# Altium schematic sheet LMR514203.3V.SchDoc
size A; SheetNumber: 10; SheetTotal: 15
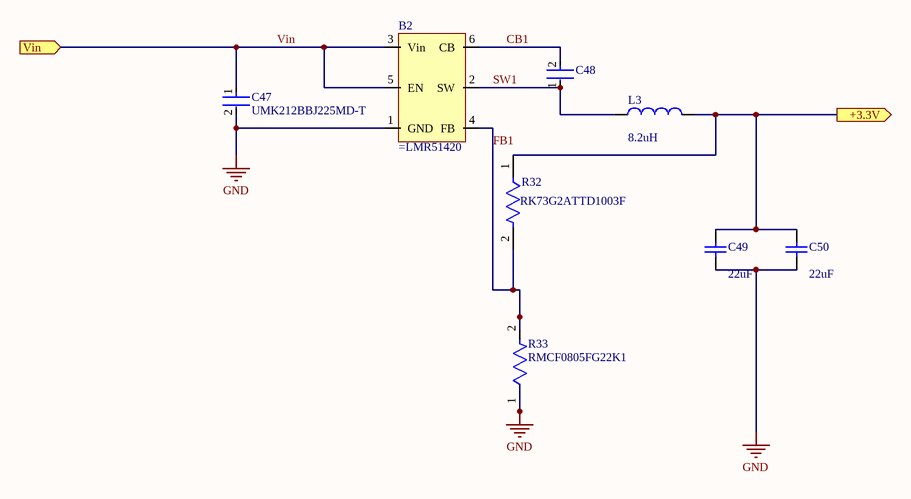
[diagram p0: LMR514203.3V.SchDoc]

## Parts
B2  (no value)  [LMR51420IC]
C47  UMK212BBJ225MD-T  [FP-0805-L_2_0_0_2-W_1_25-IPC_A]
C48  C0603C104K4PAC7867  [CAP CER 0.1UF 16V X7R 0603]  (value not drawn)
C49  value 22uF  [Cap22uF_C1206C226M4PAC7800]  (hidden comment: Comment)
C50  value 22uF  [Cap22uF_C1206C226M4PAC7800]  (hidden comment: Comment)
L3  value 8.2uH  [MSS1246H-103MED 10uH]  (hidden comment: MSS1260H-822MED)
R32  RK73G2ATTD1003F  [FP-RK73G2A-IPC_A]
R33  RMCF0805FG22K1  [FP-RMCF0805-IPC_B]

## Ports
+3.3V (out), Vin (in)

## Nets
GND: B2.1(GND) C47.2 C49.1 C50.1 R33.1
+3.3V: C49.2 C50.2 L3.2 R32.1 ; port +3.3V
CB1: B2.6(CB) C48.2
FB1: B2.4(FB) R32.2 R33.2
SW1: B2.2(SW) C48.1 L3.1
Vin: B2.3(Vin) B2.5(EN) C47.1 ; port Vin

## Library data of the parts
B2 = Component_1
C47 = CMP-14477-004278-2: Multilayer Ceramic Capacitor 2.2uF 50V X5R 20% SMD 0803 T/R; Max Operating Temperature: 85°C; Tolerance: 20%; Case Code (Imperial): 0805; Case/Package: 0805; Case Code (Metric): 2012; Capacitance: 2.2uF; Min Operating Temperature: -55°C; Mount: Surface Mount; Voltage Rating: 50V; Packaging: Tape and Reel; RoHS Compliant: Yes
C48 = b4654b650e69147ec39a6b967a45e02: CAP CER 0.1UF 16V X5R 0603; Manufacturer: KEMET; Automotive Grade: Grade 1; Value: 0.10 μF; Material: Ceramic; Temperature Coefficient: 30ppm/°C; Tolerance: 0.1; Manufacturer Part Number: C0603C104K4PAC7867; Automotive: Yes; Octopart: https://octopart.com/c0603c104k4pactu-kemet-12592163; Device Class L2: Capacitors; ComponentLink2URL: https://api.kemet.com/component-edge/download/datasheet/C0603C100J5GACAUTO.pdf; RoHS: TRUE; Height: 0.87mm; Temperature Characteristic: X5R; Voltage Rating: 16 V; Device Class L1: Passive Components; Category: Cap; Digikey Description: CAP CER 0.1UF 16V X5R 0603; Temperature Range High: +125°C; Package: C0603C-CF; Device Class L3: Ceramic Capacitors; Lead Free: Yes; Temperature: -55°C to +125°C; Temperature Range Low: -55°C; Capacitance: 0.10 μF; ComponentLink2Description: Datasheet
C49 C50 = Cap: Capacitor; Published: 8-Jun-2000; LatestRevisionDate: 17-Jul-2002; LatestRevisionNote: Re-released for DXP Platform.; PackageReference: RAD-0.3; Publisher: Altium Limited; PackageDescription: Radial Cap, Thru-Hole; 2 Leads; 0.3 in Pin Spacing
L3 = Inductor: Code_IEC: 1005; Published: 8-Jun-2000; LatestRevisionDate: 29-May-2009; LatestRevisionNote: IPC-7351 Footprint Added.; PackageReference: 0402-A; Publisher: Altium Limited; PackageDescription: Chip Inductor; Code_JEITA: 0402
R32 = CMP-04015-080178-1: 100kΩ ±1% 0.125W Chip Resistor 0805 Thick Film AEC-Q200 Qualified; Voltage Rating: 150V; Power Rating: 125mW; Temperature Coefficient: 50ppm/°C; Resistance: 100kR; Series: RK73G; Termination: SMD/SMT; Packaging: Tape and Reel; Tolerance: 1%; Case Code (Imperial): 0805; RoHS Compliant: Yes; Max Operating Temperature: 125°C; Min Operating Temperature: -55°C; Case Code (Metric): 2012
R33 = CMP-26527-006791-1: 22.1kΩ ±1% 0.125W 0805 Thick Film Chip Resistor AEC-Q200 compliant; Max Power Dissipation: 125mW; Temperature Coefficient: 100ppm/°C; Resistance: 22.1kR; Max Operating Temperature: 155°C; Length: 0.079inch; Series: RMCF; RoHS Compliant: Yes; Number of Terminations: 2; Contact Plating: Tin; Width: 0.049inch; Package Quantity: 10000; Radiation Hardening: No; Height: 0.026inch; Features: Automotive AEC-Q200; Lead Free: Lead Free; Case Code (Imperial): 0805; Packaging: Tape and Reel; Mount: Surface Mount; Case/Package: 0805; Resistor Type: Thick Film; Case Code (Metric): 2012; Min Operating Temperature: -55°C; Tolerance: 1%